# Altium schematic sheet soldering_iron 2.SchDoc
size A4
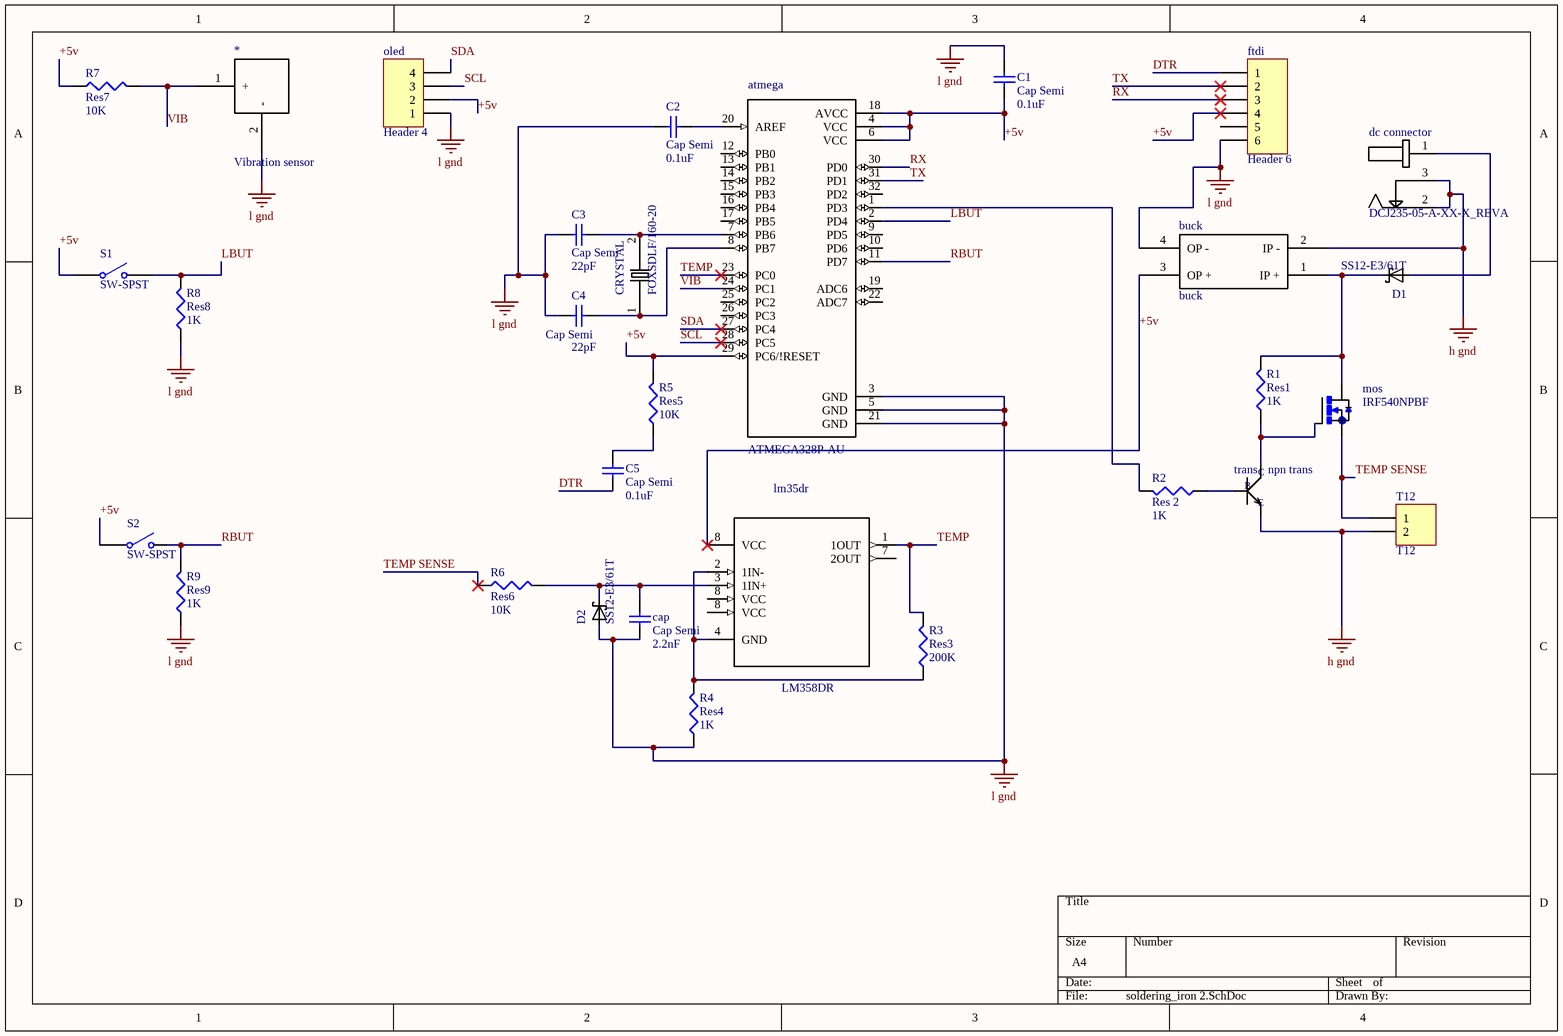
[diagram p0: soldering_iron 2.SchDoc]

## Parts
*  Vibration sensor  [PCBComponent_1]
atmega  ATMEGA328P-AU  [*QFP80P900X900X120-32N]
buck  buck  [buck]
C1  Cap Semi  value 0.1uF  [C1206]
C2  Cap Semi  value 0.1uF  [C1206]
C3  Cap Semi  value 22pF  [C1206]
C4  Cap Semi  value 22pF  [C1206]
C5  Cap Semi  value 0.1uF  [C1206]
cap  Cap Semi  value 2.2nF  [C1206]
CRYSTAL  FOXSDLF/160-20  [*XTAL_FOXSDLF/160-20]
D1  SS12-E3/61T  [*DO214AC_SS12-E3/61T(Primary)]
D2  SS12-E3/61T  [*DO214AC_SS12-E3/61T(Primary)]
dc_connector  DCJ235-05-A-XX-X_REVA  [*GCT_DCJ235-05-A-XX-X_REVA]
ftdi  Header 6  [HDR1X6]
lm35dr  LM358DR  [*SOIC127P600X175-8N]
mos  IRF540NPBF  [*D2PACK]
oled  Header 4  [HDR1X4]
R1  Res1  value 1K  [J1-0603]
R2  Res 2  value 1K  [J1-0603]
R3  Res3  value 200K  [J1-0603]
R4  Res4  value 1K  [J1-0603]
R5  Res5  value 10K  [J1-0603]
R6  Res6  value 10K  [J1-0603]
R7  Res7  value 10K  [J1-0603]
R8  Res8  value 1K  [J1-0603]
R9  Res9  value 1K  [J1-0603]
S1  SW-SPST  [SPST-2]
S2  SW-SPST  [SPST-2]
T12  T12  [HDR1X2]
trans  npn trans  [*SOT-23]

## Nets
h gnd: buck.2(IP_-) dc_connector.2 dc_connector.3 T12.2 trans.2(E)
l gnd: *.2(-) atmega.3(GND) atmega.5(GND) atmega.21(GND) buck.4(OP_-) C1.2 C2.1 C3.1 C4.1 cap.1 D2.A ftdi.6 oled.1 R4.1 R8.1 R9.1
+5v: atmega.4(VCC) atmega.6(VCC) atmega.18(AVCC) atmega.29(PC6/!RESET) buck.3(OP_+) C1.1 ftdi.4 lm35dr.8(VCC) oled.2 R5.2 R7.1 S1.1(COMMON) S2.1(COMMON)
DTR: C5.1 ftdi.1
LBUT: atmega.2(PD4) R8.2 S1.2(NO)
RBUT: atmega.11(PD7) R9.2 S2.2(NO)
RX: atmega.30(PD0) ftdi.3
SCL: atmega.28(PC5) oled.3
SDA: atmega.27(PC4) oled.4
TEMP: atmega.23(PC0) lm35dr.1(1OUT) R3.2
TEMP SENSE: mos.3(S) R6.1 T12.1
TX: atmega.31(PD1) ftdi.2
VIB: *.1(+) atmega.24(PC1) R7.2
Netatmega_1: atmega.1(PD3) R2.2
Netatmega_7: atmega.7(PB6) C3.2 CRYSTAL.2
Netatmega_8: atmega.8(PB7) C4.2 CRYSTAL.1
Netatmega_20: atmega.20(AREF) C2.2
Netbuck_1: buck.1(IP_+) D1.C mos.2(D) R1.2
NetC5_2: C5.2 R5.1
Netcap_2: cap.2 D2.C lm35dr.3(1IN+) R6.2
NetD1_A: D1.A dc_connector.1
Netlm35dr_2: lm35dr.2(1IN-) lm35dr.4(GND) R3.1 R4.2
Netmos_1: mos.1(G) R1.1 trans.3(C)
NetR2_1: R2.1 trans.1(B)

Not connected (* = marked no-connect by the designer): atmega 9(PD5) 10(PD6) 12(PB0) 13(PB1) 14(PB2) 15(PB3) 16(PB4) 17(PB5) 19(ADC6) 22(ADC7) 25(PC2) 26(PC3) 32(PD2); ftdi 5; lm35dr 7(2OUT)

## Library data of the parts
* = Component_1
atmega = ATMEGA328P-AU: Microcontroller Mcu, 8 Bit, Atmega, 20mhz, Tqfp-32; MF: Microchip; SnapEDA_Link: https://www.snapeda.com/parts/ATMEGA328P-AU/Microchip/view-part/?ref=snap; Digi-Key_Purchase_URL: https://www.digikey.com/product-detail/en/microchip-technology/ATMEGA328P-AU/ATMEGA328P-AU-ND/1832260?utm_source=snapeda&utm_medium=aggregator&utm_campaign=symbol; Digi-Key_Part_Number: ATMEGA328P-AU-ND; Package: TQFP-32 Microchip; MP: ATMEGA328P-AU; Value: *
C1-C5 cap = Cap Semi: Capacitor (Semiconductor SIM Model); Published: 8-Jun-2000; LatestRevisionDate: 29-May-2009; LatestRevisionNote: IPC-7351 Footprint Added.; PackageReference: C1206; Publisher: Altium Limited; PackageDescription: Chip Capacitor
CRYSTAL = FOXSDLF/160-20: Crystal 16MHz Â±30ppm _Tol_ Â±50ppm _Stability_ 20pF FUND 40Ohm 2-Pin HC-49/SDLF SMD T/R; MP: FOXSDLF/160-20/TR; MF: Fox Electronics; Package: None; SnapEDA_Link: https://www.snapeda.com/parts/FOXSDLF/160-20/TR/Fox%20Electronics/view-part/?ref=snap; Availability: Unavailable; Price: None; Value: *
D1 D2 = SS12-E3/61T: SS12 Series 20 V 1 A Surface Mount Schottky Barrier Rectifier - DO-214AC _SMA_; MF: Vishay Semiconductor; Availability: Unavailable; SnapEDA_Link: https://www.snapeda.com/parts/SS12-E3/61T/Vishay%20Semiconductor%20Diodes%20Division/view-part/?ref=snap; Price: None; Package: DO-214 Vishay; MP: SS12-E3/61T; Value: *
dc_connector = DCJ235-05-A-XX-X_REVA: Dc Power Jack, 5a, 20vdc, Black; MF: Global Connector Technology; MP: DCJ235-05-A-K1-A; Package: None; Price: None; SnapEDA_Link: https://www.snapeda.com/parts/DCJ235-05-A-K1-A/Global%20Connector%20Technology/view-part/?ref=snap; Availability: Unavailable; Value: *
ftdi = Header 6: Header, 6-Pin; LatestRevisionDate: 17-Jul-2002; LatestRevisionNote: Re-released for DXP Platform.; Publisher: Altium Limited
lm35dr = LM358DR: Dual Operational Amplifiers 8-SOIC 0 to 70; MF: Texas Instruments; MP: LM358DR; Price: None; Availability: Unavailable; SnapEDA_Link: https://www.snapeda.com/parts/LM358DR/Texas%20Instruments/view-part/?ref=snap; Package: SOIC-8 Texas Instruments; Value: *
mos = IRF540NPBF: Single N-Channel 100 V 44 mOhm 71 nC HEXFETÂ® Power Mosfet - TO-220-3; MF: Infineon; SnapEDA_Link: https://www.snapeda.com/parts/IRF540NPBF/Infineon%20Technologies/view-part/?ref=snap; Digi-Key_Purchase_URL: https://www.digikey.com/product-detail/en/infineon-technologies/IRF540NPBF/IRF540NPBF-ND/811869?utm_source=snapeda&utm_medium=aggregator&utm_campaign=symbol; Digi-Key_Part_Number: IRF540NPBF-ND; Package: TO-220 Infineon; MP: IRF540NPBF; Value: *
oled = Header 4: Header, 4-Pin; LatestRevisionDate: 17-Jul-2002; LatestRevisionNote: Re-released for DXP Platform.; Publisher: Altium Limited
R1-R9 = Res3: Resistor; Published: 8-Jun-2000; LatestRevisionDate: 29-May-2009; LatestRevisionNote: IPC-7351 Footprint Added.; PackageReference: J1-0603; Publisher: Altium Limited; PackageDescription: Chip Resistor
S1 S2 = SW-SPST: Single-Pole, Single-Throw Switch; Published: 24-Mar-1999; LatestRevisionDate: 17-Jul-2002; LatestRevisionNote: Re-released for DXP Platform.; PackageReference: SPST-2; Publisher: Altium Limited; PackageDescription: Switch; 2 Leads
T12 = Header 2: Header, 2-Pin; LatestRevisionDate: 17-Jul-2002; LatestRevisionNote: Re-released for DXP Platform.; Publisher: Altium Limited
trans = SMD-TRANSISTORS-NPN-25V-500MA-S9013(SOT-23): SMD Transistors NPN 25V-500mA; MP: S9013; MF: JCET; Availability: Unavailable; SnapEDA_Link: https://www.snapeda.com/parts/S9013/JCET/view-part/?ref=snap; Price: None; Package: SOT-23-3 JCET; Value: *